# EAGLE design TweetyBoy (EAGLE 9.2.0)
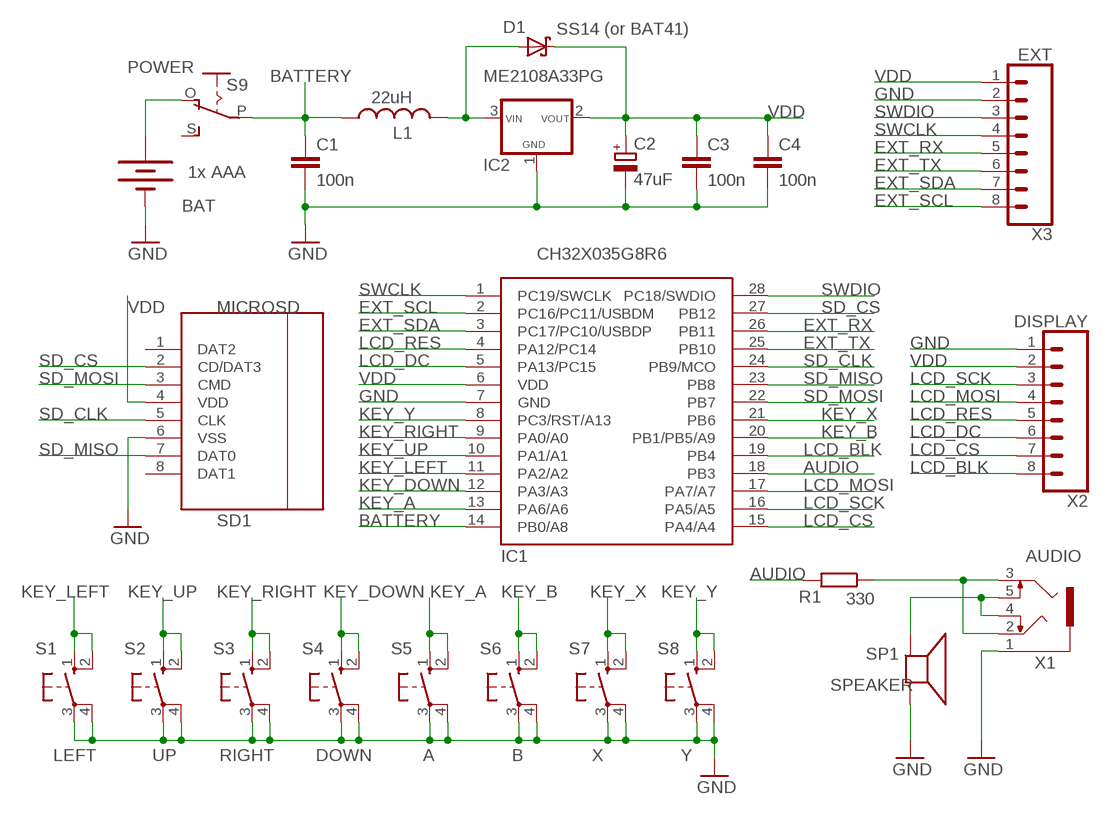
[diagram p0: schematic, sheet 1]

## Parts
BAT  1x AAA  BATTERY-AAA_KIT  [BATTERY-AAA-KIT]
C1  100n  C-EU050-024X044  [C050-024X044]
C2  47uF  CPOL-EUE2-5  [E2-5]
C3  100n  C-EU050-024X044  [C050-024X044]
C4  100n  C-EU050-024X044  [C050-024X044]
D1  SS14 (or BAT41)  SCHOTTKY-DIODEDO35-7  [DO35-7]
IC1  CH32X035G8R6  [QSOP28]
IC2  ME2108A33PG  [SOT89-R]
L1  22uH  L-USWE-TPC  [POWER-CHOKE_WE-TPC]
R1  330  R-EU_0204/7  [0204/7]
S1  LEFT  10-XX  [B3F-10XX]
S2  UP  10-XX  [B3F-10XX]
S3  RIGHT  10-XX  [B3F-10XX]
S4  DOWN  10-XX  [B3F-10XX]
S5  A  10-XX  [B3F-10XX]
S6  B  10-XX  [B3F-10XX]
S7  X  10-XX  [B3F-10XX]
S8  Y  10-XX  [B3F-10XX]
S9  POWER  EG1218S  [EG1218]
SD1  MICROSD  [MICROSD]
SP1  SPEAKER  SPEAKER/AL60P  [AL60P]
X1  AUDIO  1503_09  [1503_09]
X2  DISPLAY  CONN_08LONGPADS  [1X08_LONGPADS]
X3  EXT  CONN_08LONGPADS  [1X08_LONGPADS]

## Nets
AUDIO: IC1.18(PB3) R1.2
BATTERY: C1.1 IC1.14(PB0/A8) L1.1 S9.P
EXT_RX: IC1.26(PB11) X3.5
EXT_SCL: IC1.2(PC16/PC11/USBDM) X3.8
EXT_SDA: IC1.3(PC17/PC10/USBDP) X3.7
EXT_TX: IC1.25(PB10) X3.6
GND: BAT.GND@1(-) C1.2 C2.- C3.2 C4.2 IC1.7(GND) IC2.1(GND) S1.3(P) S1.4(P1) S2.3(P) S2.4(P1) S3.3(P) S3.4(P1) S4.3(P) S4.4(P1) S5.3(P) S5.4(P1) S6.3(P) S6.4(P1) S7.3(P) S7.4(P1) S8.3(P) S8.4(P1) SD1.6(VSS) SP1.2(-) X1.1 X2.1 X3.2
KEY_A: IC1.13(PA6/A6) S5.1(S) S5.2(S1)
KEY_B: IC1.20(PB1/PB5/A9) S6.1(S) S6.2(S1)
KEY_DOWN: IC1.12(PA3/A3) S4.1(S) S4.2(S1)
KEY_LEFT: IC1.11(PA2/A2) S1.1(S) S1.2(S1)
KEY_RIGHT: IC1.9(PA0/A0) S3.1(S) S3.2(S1)
KEY_UP: IC1.10(PA1/A1) S2.1(S) S2.2(S1)
KEY_X: IC1.21(PB6) S7.1(S) S7.2(S1)
KEY_Y: IC1.8(PC3/RST/A13) S8.1(S) S8.2(S1)
LCD_BLK: IC1.19(PB4) X2.8
LCD_CS: IC1.15(PA4/A4) X2.7
LCD_DC: IC1.5(PA13/PC15) X2.6
LCD_MOSI: IC1.17(PA7/A7) X2.4
LCD_RES: IC1.4(PA12/PC14) X2.5
LCD_SCK: IC1.16(PA5/A5) X2.3
N$2: SP1.1(+) X1.4 X1.5
N$3: BAT.PWR@1(+) S9.O
N$4: D1.A IC2.3(IN) L1.2
N$7: R1.1 X1.2 X1.3
SD_CLK: IC1.24(PB9/MCO) SD1.5(CLK)
SD_CS: IC1.27(PB12) SD1.2(CD/DAT3)
SD_MISO: IC1.23(PB8) SD1.7(DAT0)
SD_MOSI: IC1.22(PB7) SD1.3(CMD)
SWCLK: IC1.1(PC19/SWCLK) X3.4
SWDIO: IC1.28(PC18/SWDIO) X3.3
VDD: C2.+ C3.1 C4.1 D1.C IC1.6(VDD) IC2.2(VOUT) SD1.4(VDD) X2.2 X3.1
Unconnected: S9.S SD1.1(DAT2) SD1.8(DAT1)

## Library data of the parts
BAT = SparkFun-Batteries:BATTERY: Battery - Single Cell A variety of battery chemistries, sizes, and footprints. Device List: 20MM_PTH - Coin Cell Battery Holder - 20mm (PTH) <https://www.sparkfun.com/products/783> 6.8MM_PTH - Coin Cell Battery Holder - 6.8MM(SMD) <https://www.digikey.com/product-detail/en/seiko-instruments/MS621FE-FL11E/728-1057-ND/1889208?WT.srch=1&gclid=CNOQ5a6LzdQCFZS2wAodXCkE0g> 12MM_SMD - Coin Cell Battery Holder - 12mm (SMD) <https://www.sparkfun.com/products/10592> 12MM_PTH - Coin Cell Battery Holder - 12mm (PTH) <https://www.sparkfun.com/products/7948> 20MM_SMD - 20mm Coin Cell Battery Holder (SMD) (2 legs) Used on the Big Time Watch Kit <https://www.sparkfun.com/products/11734> 20MM_SMD_4LEGS - Coin Cell Battery Holder - 20mm (SMD) <https://www.sparkfun.com/products/11892> 20MM_SMD_4LEGS_OVERPASTE - Coin Cell Battery Holder - 20mm (SMD) <https://www.sparkfun.com/products/11892> (Over-paste on the legs) 24.5MM_PTH - Coin Cell Battery Holder - 24.5mm (PTH) <https://www.sparkfun.com/products/8863> 9V - 9V Battery Holder - PC Mount Used on the SparkFun SparkPunk Sound Kit <https://www.sparkfun.com/products/11177> and SparkFun SparkPunk Sequencer Kit <https://www.sparkfun.com/products/12707> 18650 - Battery Holder - 18650 (PTH) <https://www.sparkfun.com/products/13113> AA - Battery Holder - 1xAA (PTH) <https://www.sparkfun.com/products/7949> AAA - Battery Holder - 1xAAA (PTH) <https://www.sparkfun.com/products/12718> AA_KIT - Battery Holder - 1xAA (PTH) <https://www.sparkfun.com/products/7949> Special kit package - pads only have exposed copper on one side of the board. AAA_KIT - Battery Holder - 1xAAA (PTH) <https://www.sparkfun.com/products/12718> Special kit package - pads only have exposed copper on one side of the board.; PROD_ID: BATT-08571; SF_SKU: PRT-12718
C1 C3 C4 = rcl:C-EU: CAPACITOR, European symbol; SPICEPREFIX: C
C2 = rcl:CPOL-EU: POLARIZED CAPACITOR, European symbol; SPICEPREFIX: C
D1 = adafruit:SCHOTTKY-DIODE: Schottky Diode
IC1 = CH32V:CH32X035G8R6
IC2 = CH32V:ME2108A33PG
L1 = rcl:L-US: INDUCTOR, American symbol; SPICEPREFIX: L
R1 = rcl:R-EU_: RESISTOR, European symbol; SPICEPREFIX: R
S1-S8 = switch-omron:10-XX: OMRON SWITCH; MPN: B3F-1000; OC_FARNELL: 176432; OC_NEWARK: 36M3542
S9 = CH32V:EG1218: SLIDING SWITCH 0.1" spacing through hole, vertical SPDT slide switch http://www.ladyada.net/library/pcb/eaglelibrary.html
SD1 = Wuerth_Elektronik_eiCan_Communication_Connectors_v2.2:MICROSD: WR-CRD MICRO SD CARD CONNECTOR HINGE 8PINS
SP1 = adafruit_watch:SPEAKER: SPEAKER Source: Buerklin Added PS12 (for part # PS1240 piezo) http://www.ladyada.net/library/pcb/eaglelibrary.html
X1 = con-lumberg:1503_09: Jack connectors according to JISC 6560, 3.5 mm Klinkeneinbaukupplung nach JISC 6560, 3,5 mm, 3-polig/ stereo, abgewinkelte Ausführung, mit 2 Öffnern und Lötaugen, für Leiterplatten Rückseitenmontage Source: http://www.lumberg.com/Produkte/PDFs/1503_09.pdf; OC_FARNELL: 1243244; OC_NEWARK: unknown
X2 X3 = SparkFun-Connectors:CONN_08: Multi connection point. Often used as Generic Header-pin footprint for 0.1 inch spaced/style header connections On any of the 0.1 inch spaced packages, you can populate with these: Break Away Headers - Straight <https://www.sparkfun.com/products/116> (PRT-00116) Break Away Male Headers - Right Angle <https://www.sparkfun.com/products/553> (PRT-00553) Female Headers <https://www.sparkfun.com/products/115> (PRT-00115) Break Away Headers - Machine Pin <https://www.sparkfun.com/products/117> (PRT-00117) Break Away Female Headers - Swiss Machine Pin <https://www.sparkfun.com/products/743> (PRT-00743) Arduino Stackable Header - 8 Pin <https://www.sparkfun.com/products/9279> (PRT-09279) For SCREWTERMINALS and SPRING TERMINALS visit here: Screw Terimnals on SparkFun.com <https://www.sparkfun.com/search/results?term=Screw+Terminals> (5mm/3.5mm/2.54mm spacing) This device is also useful as a general connection point to wire up your design to another part of your project. Our various solder wires solder well into these plated through hole pads. Hook-Up Wire - Assortment (Stranded, 22 AWG) <https://www.sparkfun.com/products/11375> (PRT-11375) Hook-Up Wire - Assortment (Solid Core, 22 AWG) <https://www.sparkfun.com/products/11367> (PRT-11367) View the entire wire category on our website here <https://www.sparkfun.com/categories/141> Special notes: Molex polarized connector foot print use with SKU : PRT-08231 with associated crimp pins and housings. 1MM SMD Version SKU: PRT-10208 NOTES ON THE VARIANTS LOCK and LOCK_LONGPADS... This footprint was designed to help hold the alignment of a through-hole component (i.e. 6-pin header) while soldering it into place. You may notice that each hole has been shifted either up or down by 0.005 of an inch from it's more standard position (which is a perfectly straight line). This slight alteration caused the pins (the squares in the middle) to touch the edges of the holes. Because they are alternating, it causes a "brace" to hold the component in place. 0.005 has proven to be the perfect amount of "off-center" position when using our standard breakaway headers. Although looks a little odd when you look at the bare footprint, once you have a header in there, the alteration is very hard to notice. Also,if you push a header all the way into place, it is covered up entirely on the bottom side.

## Board
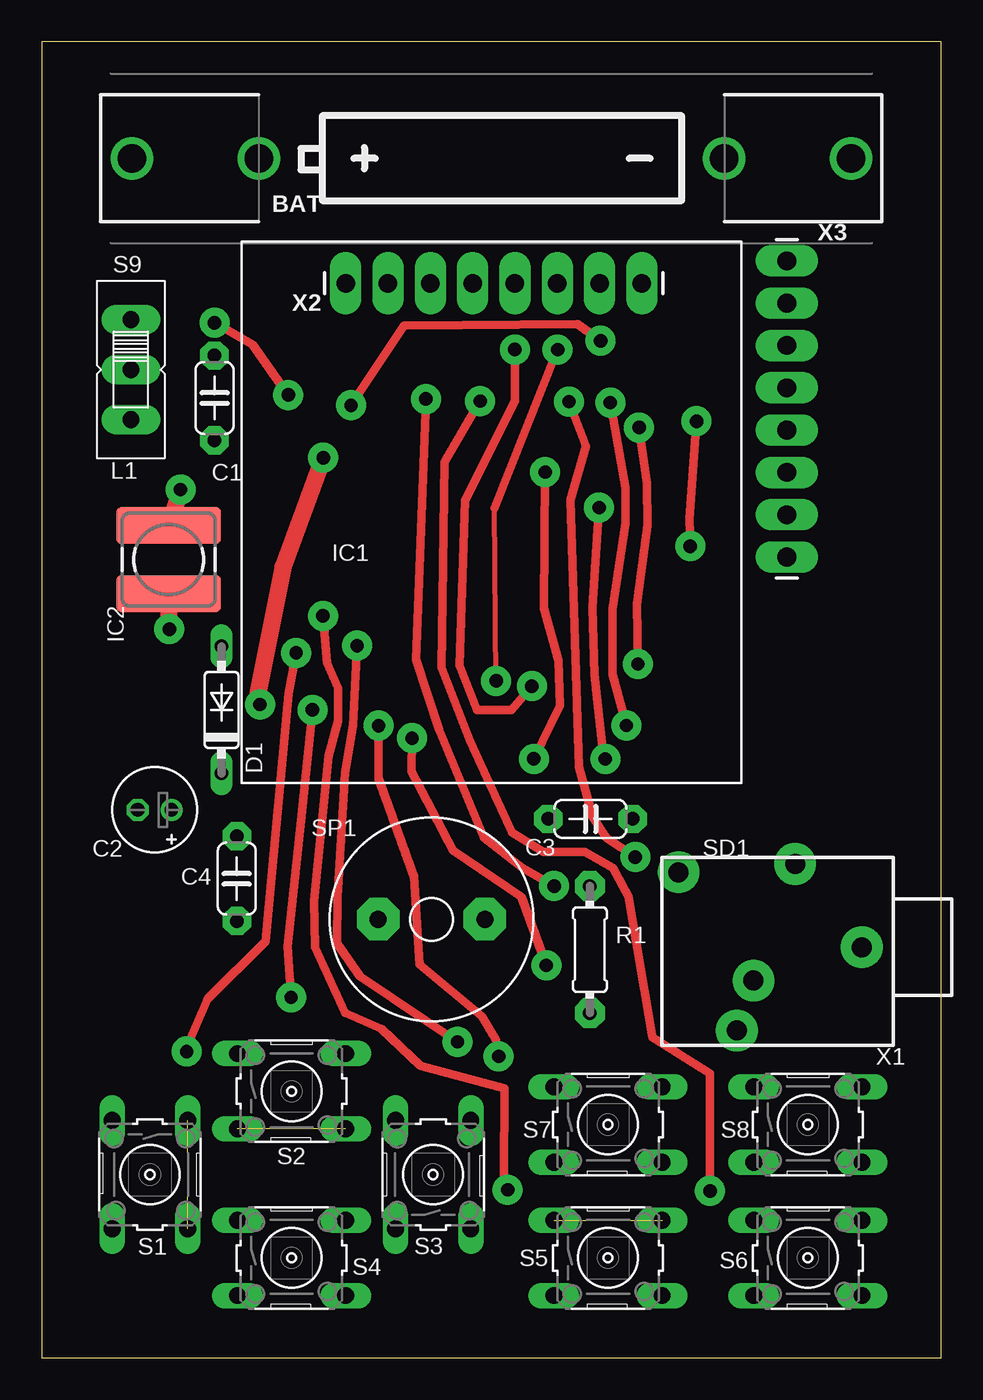
[diagram p1: board, top side]
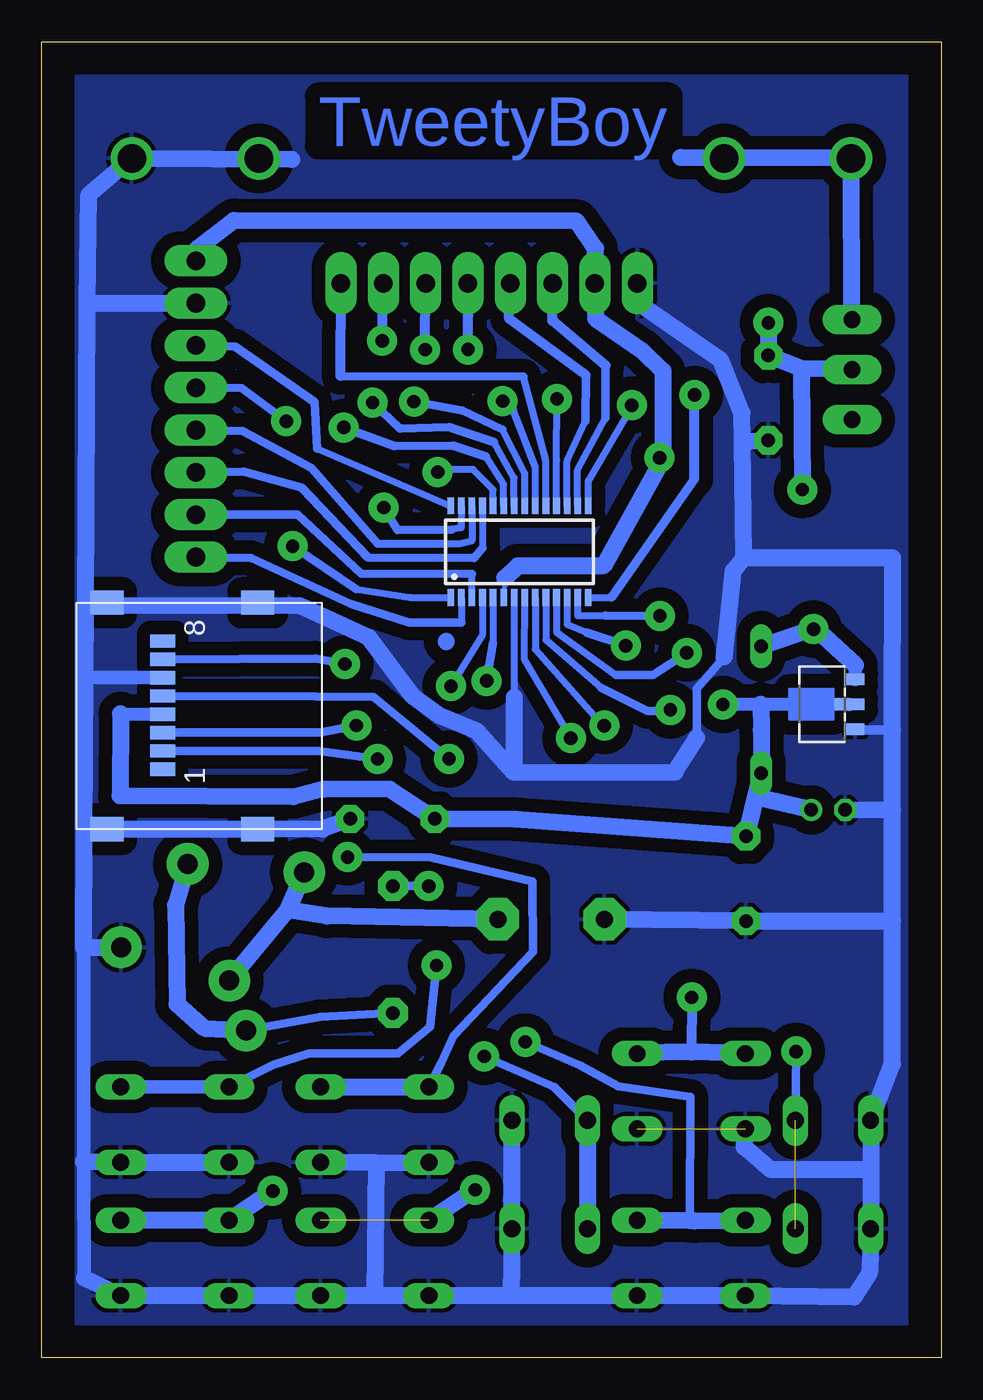
[diagram p2: board, bottom side, seen from below]

Size 54 x 79 mm. Coordinates in mm from the lower left corner, seen from the top.
Outline: 0,0 54,0 54,79 0,79 0,0
Copper layers (1*16): Top 0.035mm / dielectric 1.5mm / Bottom 0.035mm
Design rules "default": minimum track width 6mil, minimum drill 0.35mm, track to track 6mil, track to pad 6mil, pad to pad 6mil, via to via 6mil, smd to smd 6mil, copper to edge 40mil, drill to drill 6mil, minimum pad ring 10mil, minimum via ring 8mil, stop-mask expansion 4mil, vias tented up to drill 0mil, thermal gap 10mil

### Footprints (pad centres in the part's own frame; a part is rotated, then mirrored left to right if it is on the bottom)
BATTERY-AAA-KIT = drill 1.702: GND@1 21.59,0; GND@2 13.97,0; PWR@1 -21.59,0; PWR@2 -13.97,0
C050-024X044 = drill 0.813 pad 1.7 octagon: 1 -2.54,0; 2 2.54,0
E2-5 = drill 0.813 pad 1.27: + -1.016,0 | drill 0.813 pad 1.27 octagon: - 1.016,0
DO35-7 = drill 0.813 long: A 3.81,0; C -3.81,0
QSOP28 = smd 0.4 x 1: 1 -4.128,-2.75; 2 -3.493,-2.75; 3 -2.858,-2.75; 4 -2.223,-2.75; 5 -1.587,-2.75; 6 -0.952,-2.75; 7 -0.317,-2.75; 8 0.318,-2.75; 9 0.953,-2.75; 10 1.588,-2.75; 11 2.223,-2.75; 12 2.858,-2.75; 13 3.493,-2.75; 14 4.128,-2.75; 15 4.128,2.75; 16 3.493,2.75; 17 2.858,2.75; 18 2.223,2.75; 19 1.588,2.75; 20 0.953,2.75; 21 0.318,2.75; 22 -0.317,2.75; 23 -0.952,2.75; 24 -1.587,2.75; 25 -2.223,2.75; 26 -2.858,2.75; 27 -3.493,2.75; 28 -4.128,2.75
SOT89-R = smd 0.7 x 1.1: 1 -1.5,-1.75; 3 1.5,-1.75 | smd 0.7 x 1.8: 2 0,-1.4
POWER-CHOKE_WE-TPC = smd 6.3 x 2.2: 1 0,2.05; 2 0,-2.05
0204/7 = drill 0.813 pad 1.8 octagon: 1 -3.81,0; 2 3.81,0
B3F-10XX = drill 1.016 long: 1 -3.251,2.261; 2 3.251,2.261; 3 -3.251,-2.261; 4 3.251,-2.261
EG1218 = drill 1 pad 1.778 long: O -3,0; P 0,0; S 3,0
MICROSD = smd 0.8 x 1.5: 1 2.62,-2.54; 2 1.52,-2.54; 3 0.42,-2.54; 4 -0.68,-2.54; 5 -1.78,-2.54; 6 -2.88,-2.54; 7 -3.98,-2.54; 8 -5.08,-2.54 | smd 1.45 x 2: Z1 -7.38,3.16; Z2 6.22,3.16; Z3 -7.38,-5.89; Z4 6.22,-5.89
AL60P = drill 1.016 pad 2.54 octagon: 1 -3.2,0; 2 3.2,0
1503_09 = drill 1.2 pad 2.5: 1 0,-2; 2 -5,-6; 3 5,-9.5; 4 -4.5,-13; 5 2,-8.5
1X08_LONGPADS = drill 1.118 pad 1.88 long: 1 0,0; 2 2.54,0; 3 5.08,0; 4 7.62,0; 5 10.16,0; 6 12.7,0; 7 15.24,0; 8 17.78,0

### Placement (x,y rotation side)
BAT  27,72 0 top
C1  10.38,57.62 270 top
C2  6.78,32.9 180 top
C3  32.94,32.35 0 top
C4  11.71,28.76 270 top
D1  10.8,38.89 90 top
IC1  25.32,48.38 0 bottom
IC2  6.9,39.22 90 bottom
L1  7.63,47.91 0 top
R1  32.91,24.5 90 top
S1  6.5,11 270 top
S2  15,16 0 top
S3  23.5,11 90 top
S4  15,6 0 top
S5  34,6 0 top
S6  46,6 0 top
S7  34,14 0 top
S8  46,14 0 top
S9  5.35,59.31 270 top
SD1  44.19,37.95 270 bottom
SP1  23.4,26.32 180 top
X1  51.24,24.64 270 top
X2  18.25,64.5 0 top
X3  44.74,65.84 270 top

### Tracks (layer width: path | path; a pad name or v marks a point on that pad's centre or on a via)
AUDIO  (via drill 0.8 pad 1.8)
  Top 0.508: v23.07,57.56 22.48,41.91 23.86,37.72 26.56,31.2 28.87,29.4 v30.77,28.31
  Bottom 0.406: IC1.18 23.09,53.88 v23.07,57.56
  Bottom 0.508: v30.77,28.31 R1.2
BATTERY  (via drill 0.8 pad 1.8)
  Top 0.508: v14.8,57.8 12.67,60.81 v10.38,62.12
  Top 1.016: v8.34,52.12 L1.1
  Bottom 0.406: IC1.14 19.79,45.63
  Bottom 0.508: 19.79,45.63 14.83,52.75
  Bottom 0.61: 14.83,52.75 v14.8,57.8
  Bottom 1.016: S9.P 8.38,59.37 | 8.38,59.37 C1.1 v10.38,62.12 | 8.38,59.37 v8.34,52.12
EXT_RX
  Bottom 0.406: IC1.26 28.18,49.04 28.91,48.85 29.72,48.85
  Bottom 0.508: 29.72,48.85 33.84,48.88 37.78,53.4 41.95,55.63 X3.5
EXT_SCL
  Bottom 0.406: IC1.2 28.81,44.14
  Bottom 0.508: 28.81,44.14 31.94,44.13 35.41,45.25 41.43,48.02 X3.8
EXT_SDA
  Bottom 0.406: IC1.3 28.16,47.06
  Bottom 0.508: 28.16,47.06 34.81,47.07 38.63,50.63 40.86,50.6 X3.7
EXT_TX
  Bottom 0.406: IC1.25 27.53,48.6
  Bottom 0.508: 27.53,48.6 28.05,48.02 34.4,48.02 38.38,52.22 41.88,53.2 X3.6
GND  (1 unrouted)
  Bottom 0.406: IC1.7 25.64,39.66
  Bottom 0.508: 14.67,37.22 14.66,40.16 13.03,42.07
  Bottom 0.61: IC2.1 2.92,37.69
  Bottom 0.813: 51.44,4.78 51.48,11.79 51.48,24.63 | 18.19,63.29 X2.1 | SD1.6 51.39,40.84
  Bottom 1.016: 4.24,11.29 S1.3 2.93,17.64 2.92,26.24 | 4.24,11.29 S1.4 4.29,5.15 5.24,3.64 S4.3 S4.4 25.81,3.74 | 25.81,3.74 S5.3 34,3.74 | 34,3.74 S5.4 S6.3 S6.4 51.44,4.78 | 25.81,3.74 S3.3 S3.4 | 4.24,11.29 10.21,11.29 11.82,12.65 S2.3 | 51.48,11.79 S8.4 S8.3 | 34,3.74 33.9,11.7 | 33.9,11.7 S7.3 | 33.9,11.7 S7.4 | X1.1 51.48,24.63 51.44,31.72 | 51.44,31.72 51.39,40.84 51.37,45.13 | 51.37,45.13 51.27,63.32 | 51.27,63.32 X3.2 | 51.27,63.32 51.17,69.8 BAT.GND@1 38.97,71.93 | 2.92,26.24 2.92,32.86 | 2.92,32.86 2.92,37.69 2.92,48.01 11.85,48.02 | 11.85,48.02 11.92,55.01 | 11.92,55.01 C1.2 | 11.92,55.01 11.96,56.72 13.23,59.87 18.19,63.29 | 2.92,32.86 C2.- | 2.92,26.24 C4.2 SP1.2 | C3.2 37.12,31.73 40.66,31.72 51.44,31.72 | 51.37,45.13 38.53,45.15 34.35,43.24 31.69,39.69 30.09,38.53 27.84,37.6 25.65,35.15 | 25.64,39.66 25.65,35.15 | 25.65,35.15 15.98,35.15 14.67,37.22 | 13.03,42.07 12.48,47.23 11.85,48.02
  pour Bottom (isolate 0.813): 2,2 2,77 52,77 52,2
KEY_A  (via drill 0.8 pad 1.8)  (1 unrouted)
  Top 0.508: v16.89,44.53 17.15,41.72 17.79,40.19 17.78,38.22 17.21,36.13 16.36,27.43 16.42,24.64 18.2,20.7 20.41,19.75 22.73,17.52 27.79,16.17 27.74,10.92 v27.98,10.08
  Bottom 0.406: IC1.13 21.83,44.55 20.15,44.55
  Bottom 0.508: 20.15,44.55 v16.89,44.53
  Bottom 1.016: v27.98,10.08 S5.1
KEY_B  (via drill 0.8 pad 1.8)
  Top 0.508: v26.32,57.42 24.18,53.76 23.99,41.43 25.7,37.02 28.22,31.53 30.13,30.36 32.6,30.37 34.29,29.4 35.22,27.7 36.68,19.23 40.12,17.08 v40.12,10.02
  Bottom 0.406: IC1.20 24.36,53.45 25.7,56.91
  Bottom 0.508: 25.7,56.91 v26.32,57.42
  Bottom 1.016: S6.2 S6.1 v40.12,10.02
KEY_DOWN  (via drill 0.8 pad 1.8)
  Top 0.508: v18.94,42.74 18.69,37.96 18.23,35.14 17.75,27.65 17.75,24.88 19.11,22.9 v24.97,18.97
  Bottom 0.406: IC1.12 22.46,44.02 21.3,43.54
  Bottom 0.508: 21.3,43.54 v18.94,42.74 | v24.97,18.97 21.69,17.55 19.37,16.29 15.05,15.67 15.09,8.23
  Bottom 1.016: S4.1 14.8,8.21 15.09,8.23 S4.2
KEY_LEFT  (via drill 0.8 pad 1.8)  (1 unrouted)
  Top 0.305: 8.75,18.69 v8.71,18.39
  Top 0.508: v15.28,42.32 14.83,39.87 13.45,25 9.97,21.55 8.75,18.69
  Bottom 0.406: IC1.11 23.09,43.56 19.53,41
  Bottom 0.508: 19.53,41 17.31,41 v15.28,42.32 | v8.71,18.39 S1.1
KEY_RIGHT  (via drill 0.8 pad 1.8)
  Top 0.508: v20.22,37.95 20.23,34.79 22.35,28.86 22.7,23.61 26.45,20.51 27.28,19.08 v27.43,18.09
  Bottom 0.305: 20.41,38.06 20.14,37.78 v20.22,37.95
  Bottom 0.406: IC1.9 24.37,42.53 20.41,38.06
  Bottom 0.508: v27.43,18.09 23.24,16.25 S3.2
  Bottom 1.016: S3.2 S3.1
KEY_UP  (via drill 0.8 pad 1.8)
  Top 0.508: v16.26,38.9 15.59,32.27 14.76,24.7 v14.97,21.63
  Bottom 0.305: 18.22,18.32 S2.2
  Bottom 0.406: IC1.10 23.73,43.09 20.4,40.2
  Bottom 0.508: 20.4,40.2 17.63,38.83 16.25,38.81 v16.26,38.9
  Bottom 0.61: v14.97,21.63 14.99,18.36
  Bottom 1.016: S2.1 14.99,18.36 18.22,18.32
KEY_X  (via drill 0.8 pad 1.8)
  Top 0.508: v31.66,57.39 32.67,54.73 31.75,51.49 32.25,35.48 33.08,32.43 33.92,31.21 v35.64,30.06
  Bottom 0.406: IC1.21 25,53.08 26.34,55.71
  Bottom 0.508: 26.34,55.71 28.74,56.86 v31.66,57.39 | v35.64,30.06 30.62,30.03 24.54,28.61 24.5,24.36 29.28,19.32 30.03,17.68 S7.1
  Bottom 1.016: S7.2 S7.1
KEY_Y  (via drill 0.8 pad 1.8)
  Top 0.508: v30.29,23.56 28.8,27.65 24.7,30.45 22.21,35.2 v22.23,37.19
  Bottom 0.406: v22.23,37.19 25,41.91 IC1.8
  Bottom 0.508: S8.1 40.1,17.59 37.94,18.29 32.61,18.29 30.69,19.86 v30.29,23.56
  Bottom 0.813: S8.2 S8.1
LCD_BLK
  Bottom 0.406: IC1.19 23.73,53.87 25.07,58.91
  Bottom 0.508: 25.07,58.91 36.06,58.93
  Bottom 0.61: 36.06,58.93 X2.8
LCD_CS  (via drill 0.8 pad 1.8)
  Top 0.508: v18.58,57.17 21.75,61.95 32.16,62.05 v33.55,61.04
  Bottom 0.406: IC1.15 21.19,52.63 18.8,56.67 v18.58,57.17
  Bottom 0.61: v33.55,61.04 X2.7
LCD_DC  (via drill 0.8 pad 1.8)
  Top 0.305: v27.29,40.63 27.2,51.01
  Top 0.508: 27.2,51.01 v30.98,60.51
  Bottom 0.406: IC1.5 26.9,42.91
  Bottom 0.508: 26.9,42.91 v27.29,40.63
  Bottom 0.61: v30.98,60.51 X2.6
LCD_MOSI
  Bottom 0.406: IC1.17 22.45,53.82 21.34,56.23
  Bottom 0.508: 21.34,56.23 21.33,58.97
  Bottom 0.61: 21.33,58.97 25.94,62.37 X2.4
LCD_RES  (via drill 0.8 pad 1.8)
  Top 0.508: v29.43,40.31 28.2,38.9 26.14,38.9 25.09,41.55 25.41,51.47 28.43,57.41 v28.4,60.52
  Bottom 0.406: IC1.4 27.54,43.38 v29.43,40.31
  Bottom 0.61: v28.4,60.52 28.4,62.53 X2.5
LCD_SCK
  Bottom 0.406: IC1.16 21.83,53.29 20.15,56.41
  Bottom 0.508: 20.15,56.41 20.14,59.56
  Bottom 0.61: 20.14,59.56 23.35,62.25 X2.3
N$2
  Bottom 1.016: SP1.1 36.88,26.52 39.23,26.88 | X1.4 39.23,26.88 | 39.23,26.88 X1.5
N$3
  Bottom 1.016: S9.O BAT.PWR@1 15.64,72.03
N$4  (via drill 0.8 pad 1.8)
  Top 1.016: v7.67,43.73 L1.2
  Bottom 0.813: IC2.3 5.15,41.58 | 7,43.28 v7.67,43.73
  Bottom 1.016: 5.15,41.58 7,43.28 | v7.67,43.73 D1.A
N$7
  Bottom 0.508: X1.3 37.29,20.48 R1.1
  Bottom 1.016: X1.2 45.97,27.16 45.87,21.24 44.2,19.78 X1.3
SD_CLK  (via drill 0.8 pad 1.8)
  Top 0.508: v30.22,53.17 30.16,44.98 31.04,41.85 31.11,39.15 v29.54,35.95
  Bottom 0.406: IC1.24 26.9,52.11 28.1,53.32 29.58,53.31 v30.22,53.17
  Bottom 0.508: SD1.5 37.51,39.7 34.07,39.65 32.9,38.72 v29.54,35.95
SD_CS  (via drill 0.8 pad 1.8)
  Top 0.305: 33.75,35.8 v33.83,35.95
  Top 0.508: v33.46,51.03 33.05,45.05 33.18,41.02 33.75,35.8
  Bottom 0.406: IC1.27 28.82,49.83 29.38,49.7
  Bottom 0.508: SD1.2 37.37,36.42 v33.83,35.95 | 29.38,49.7 32.63,49.7 v33.46,51.03
SD_MISO  (via drill 0.8 pad 1.8)
  Top 0.508: v35.86,55.84 36.32,52.51 36.35,49.97 35.73,45.25 v35.8,41.64
  Bottom 0.406: IC1.23 26.27,52.44 27.33,54.1
  Bottom 0.508: SD1.7 37.57,41.96 v35.8,41.64 | 27.33,54.1 29.3,54.76 32.82,54.72 v35.86,55.84
SD_MOSI  (via drill 0.8 pad 1.8)
  Top 0.508: v34.14,57.34 35.05,52.22 35.05,50.06 34.26,44.92 34.26,41.05 v35.11,37.95
  Bottom 0.406: IC1.22 25.64,52.81 26.84,54.97
  Bottom 0.508: SD1.3 37.26,37.54 v35.11,37.95 | 26.84,54.97 29.55,55.87 32.49,55.78 v34.14,57.34
SWCLK  (via drill 0.8 pad 1.8)
  Top 0.508: v39.31,56.22 38.89,50.31 v38.93,48.71
  Bottom 0.406: 35.14,46.15 31.83,45.64 IC1.1
  Bottom 0.508: X3.4 42,58.21 v39.31,56.22 | v38.93,48.71 35.14,46.15
SWDIO
  Bottom 0.406: IC1.28 37.47,54.57
  Bottom 0.508: 37.47,54.57 37.62,57.37 42.39,60.69 X3.3
VDD  (via drill 0.8 pad 1.8)
  Top 0.813: 12.97,39.84 v13.11,39.22
  Top 1.016: v16.91,54.02 14.48,47.49 12.97,39.84
  Bottom 0.305: 26.2,46.81 IC1.6 | 16.71,53.97 v16.91,54.02
  Bottom 0.813: SD1.4 49.26,38.65 | IC2.2 10.82,39.23 v13.11,39.22
  Bottom 1.016: X3.1 44.66,66.59 42.47,68.25 21.87,68.22 20.75,66.59 X2.2 20.75,62.39 17.97,60.46 16.69,59.23 16.71,53.97 20.28,47.54 25.43,47.54 26.2,46.81 | 49.26,38.65 49.29,33.73 38.88,33.68 37.07,34.14 33.11,34.12 C3.1 25.58,32.32 C4.1 11.14,33.67 | 10.82,39.23 10.8,37.67 D1.C 11.14,33.67 | C2.+ 11.14,33.67
(copper drawn outside any net)
  shapes: Bottom circle x1

### Text on the board
Bottom: TweetyBoy
Document: 1 | 2 | 3 | 4 | 5 | 6 | 7 | 8 | 1 | VCC | 2 | 3 | 4 | 5 | 6 | 7 | 8 | 8 | 1